# EAGLE design SCC (EAGLE 9.6.2)
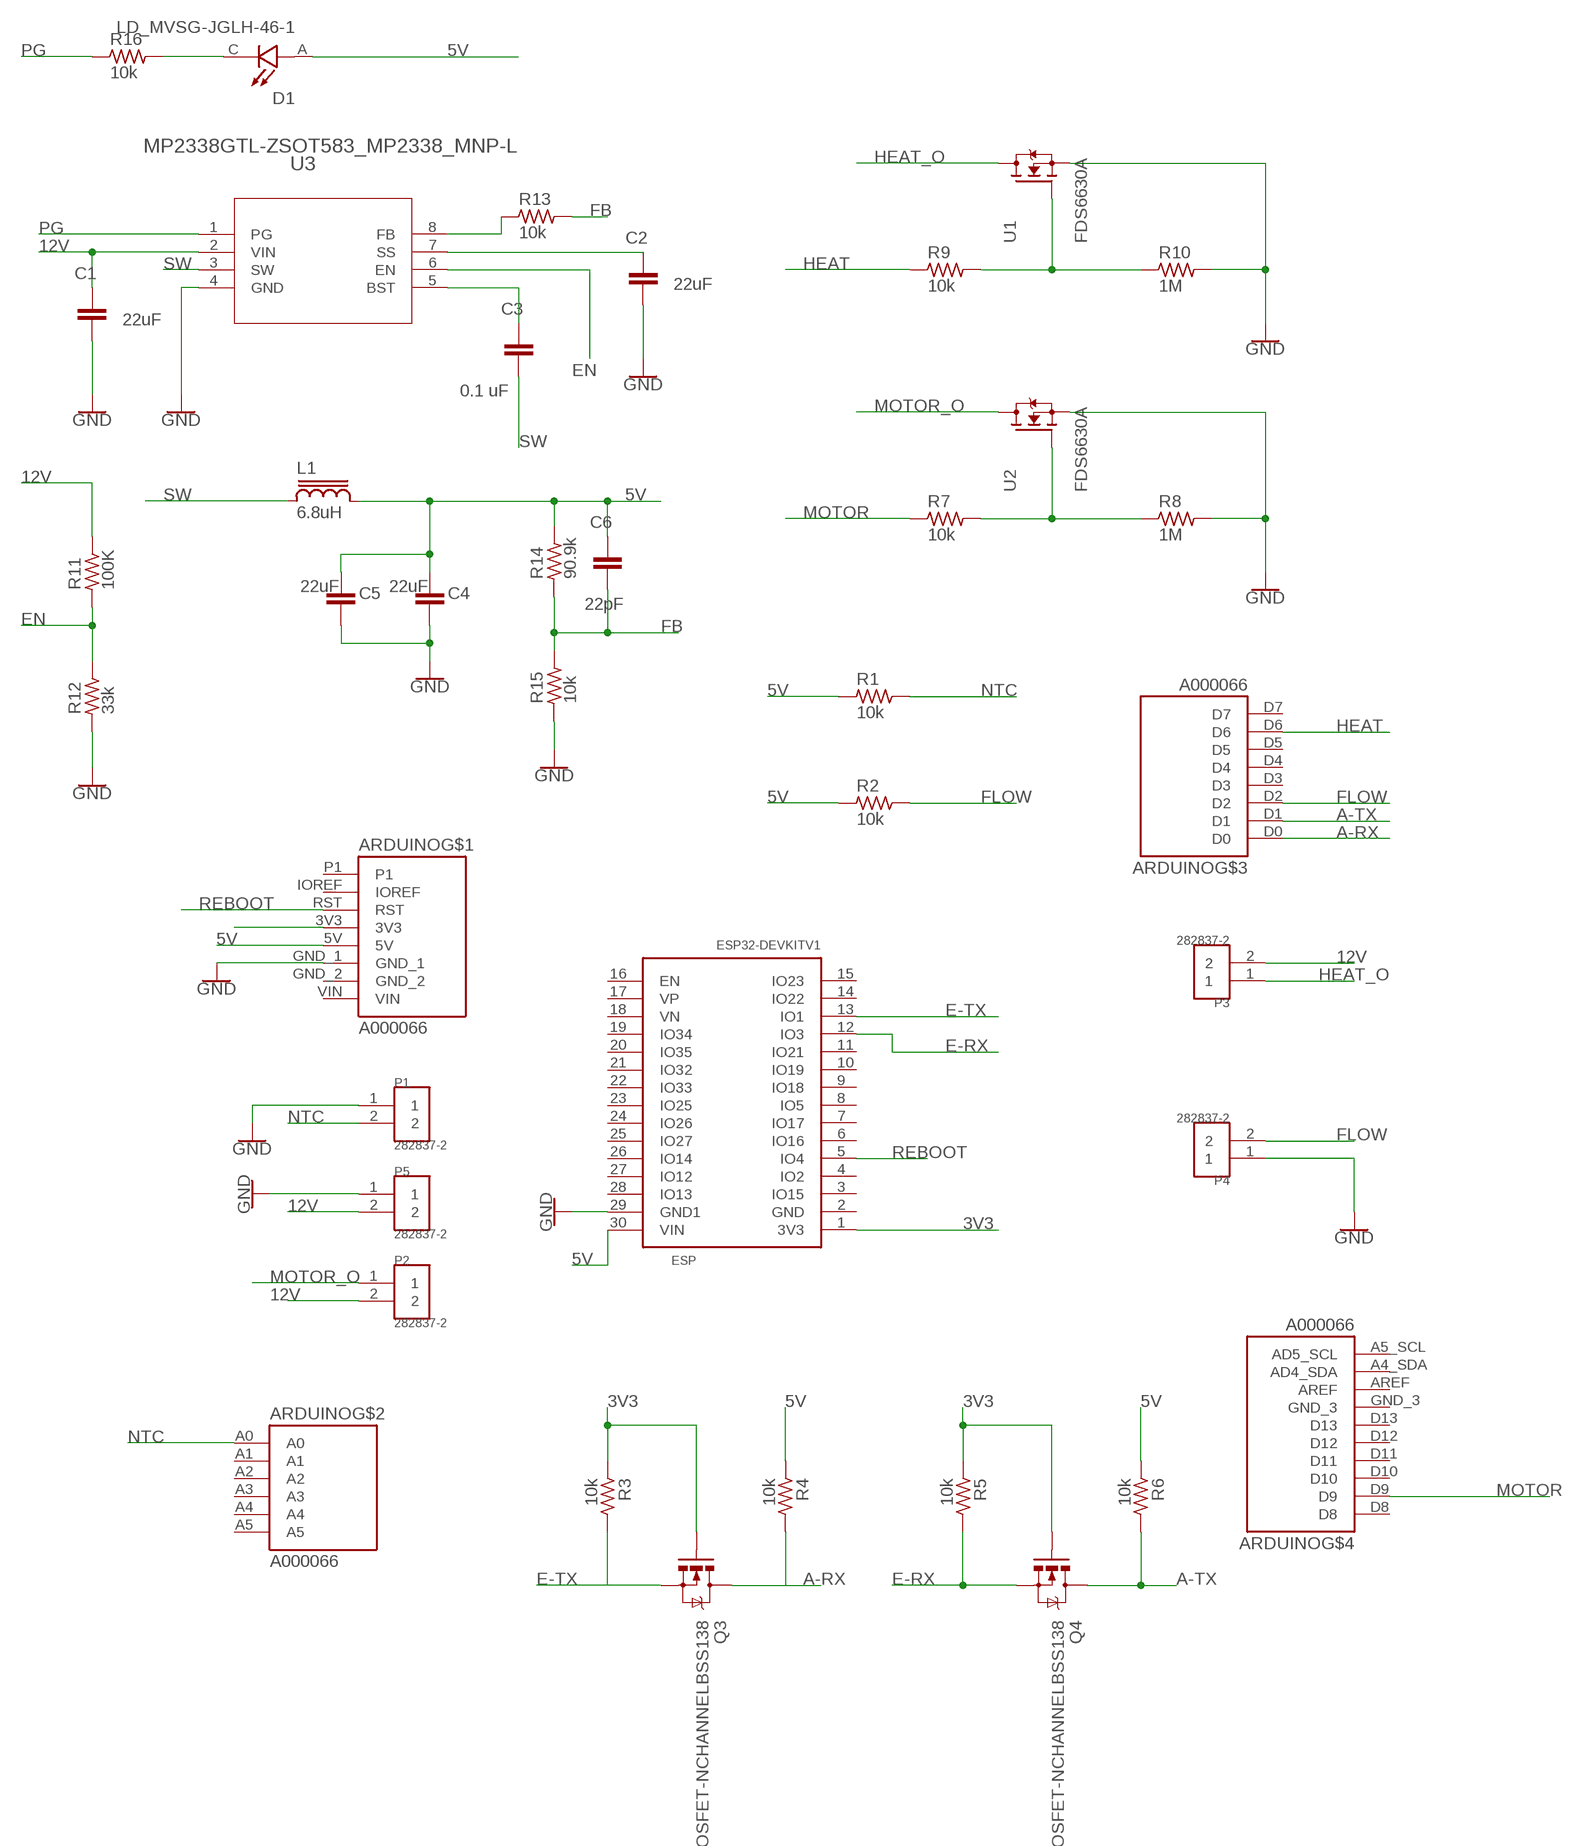
[diagram p0: schematic, sheet 1]

## Parts
ARDUINO  A000066  [ARDUINO_A000066]
C1  22uF  GRM31CR60J107ME39L  [CAP_1206]
C2  22uF  GRM31CR60J107ME39L  [CAP_1206]
C3  0.1 uF  CC0805KRX7R9BB104  [CAP_0805]
C4  22uF  GRM31CR60J107ME39L  [CAP_1206]
C5  22uF  GRM31CR60J107ME39L  [CAP_1206]
C6  22pF  CC0805KRX7R9BB104  [CAP_0805]
D1  LD_MVSG-JGLH-46-1  [LED_LD_MVSG-JGLH-46-1]
ESP  ESP32DEVKITV1  [ESP32-DEVKITV1]
L1  6.8uH  INDUCTOR-BOURNS_SRN8040  [INDUCTOR-BOURNS_SRN8040]
P1  282837-2  [TE_282837-2]
P2  282837-2  [TE_282837-2]
P3  282837-2  [TE_282837-2]
P4  282837-2  [TE_282837-2]
P5  282837-2  [TE_282837-2]
Q3  MOSFET-NCHANNELBSS138  [SOT23]
Q4  MOSFET-NCHANNELBSS138  [SOT23]
R1  10k  RC-MASTER-SMD_R_0603MP  [RC-MASTER-SMD_R0603MP]
R2  10k  RC-MASTER-SMD_R_0603MP  [RC-MASTER-SMD_R0603MP]
R3  10k  RC-MASTER-SMD_R_0603MP  [RC-MASTER-SMD_R0603MP]
R4  10k  RC-MASTER-SMD_R_0603MP  [RC-MASTER-SMD_R0603MP]
R5  10k  RC-MASTER-SMD_R_0603MP  [RC-MASTER-SMD_R0603MP]
R6  10k  RC-MASTER-SMD_R_0603MP  [RC-MASTER-SMD_R0603MP]
R7  10k  RC-MASTER-SMD_R_0603MP  [RC-MASTER-SMD_R0603MP]
R8  1M  RC-MASTER-SMD_R_0603MP  [RC-MASTER-SMD_R0603MP]
R9  10k  RC-MASTER-SMD_R_0603MP  [RC-MASTER-SMD_R0603MP]
R10  1M  RC-MASTER-SMD_R_0603MP  [RC-MASTER-SMD_R0603MP]
R11  100K  RC-MASTER-SMD_R_0603MP  [RC-MASTER-SMD_R0603MP]
R12  33k  RC-MASTER-SMD_R_0603MP  [RC-MASTER-SMD_R0603MP]
R13  10k  RC-MASTER-SMD_R_0603MP  [RC-MASTER-SMD_R0603MP]
R14  90.9k  RC-MASTER-SMD_R_0603MP  [RC-MASTER-SMD_R0603MP]
R15  10k  RC-MASTER-SMD_R_0603MP  [RC-MASTER-SMD_R0603MP]
R16  10k  RC-MASTER-SMD_R_0603MP  [RC-MASTER-SMD_R0603MP]
U1  FDS6630A  [SOIC127P600X175-8N]
U2  FDS6630A  [SOIC127P600X175-8N]
U3  MP2338GTL-ZSOT583_MP2338_MNP-L  [SOT583_MP2338_MNP-L]

## Nets
3V3: ESP.1(3V3) Q3.1(G) Q4.1(G) R3.1 R5.1
5V: ARDUINO.5V C4.1 C5.1 C6.1 D1.A ESP.30(VIN) L1.2 R1.1 R2.1 R4.1 R6.1 R14.2
12V: C1.1 P2.2 P3.2 P5.2 R11.2 U3.2(VIN)
A-RX: ARDUINO.D0 Q3.3(D) R4.2
A-TX: ARDUINO.D1 Q4.3(D) R6.2
E-RX: ESP.12(IO3) Q4.2(S) R5.2
E-TX: ESP.13(IO1) Q3.2(S) R3.2
EN: R11.1 R12.2 U3.6(EN)
FB: C6.2 R13.2 R14.1 R15.2
FLOW: ARDUINO.D2 P4.2 R2.2
GND: ARDUINO.GND_1 C1.2 C2.2 C4.2 C5.2 ESP.29(GND1) P1.1 P4.1 P5.1 R8.2 R10.2 R12.1 R15.1 U1.1(S) U1.2(S) U1.3(S) U2.1(S) U2.2(S) U2.3(S) U3.4(GND)
HEAT: ARDUINO.D6 R9.1
HEAT_O: P3.1 U1.5(D) U1.6(D) U1.7(D) U1.8(D)
MOTOR: ARDUINO.D9 R7.1
MOTOR_O: P2.1 U2.5(D) U2.6(D) U2.7(D) U2.8(D)
N$1: ARDUINO.3V3
N$2: R7.2 R8.1 U2.4(G)
N$3: R9.2 R10.1 U1.4(G)
N$4: C3.1 U3.5(BST)
N$5: C2.1 U3.7(SS)
N$7: D1.C R16.2
N$8: R13.1 U3.8(FB)
NTC: ARDUINO.A0 P1.2 R1.2
PG: R16.1 U3.1(PG)
REBOOT: ARDUINO.RST ESP.5(IO4)
SW: C3.2 L1.1 U3.3(SW)
Unconnected: ARDUINO.A1 ARDUINO.A2 ARDUINO.A3 ARDUINO.A4 ARDUINO.A4_SDA(AD4_SDA) ARDUINO.A5 ARDUINO.A5_SCL(AD5_SCL) ARDUINO.AREF ARDUINO.D3 ARDUINO.D4 ARDUINO.D5 ARDUINO.D7 ARDUINO.D8 ARDUINO.D10 ARDUINO.D11 ARDUINO.D12 ARDUINO.D13 ARDUINO.IOREF ARDUINO.P1 ESP.2(GND) ESP.3(IO15) ESP.4(IO2) ESP.6(IO16) ESP.7(IO17) ESP.8(IO5) ESP.9(IO18) ESP.10(IO19) ESP.11(IO21) ESP.14(IO22) ESP.15(IO23) ESP.16(EN) ESP.17(VP) ESP.18(VN) ESP.19(IO34) ESP.20(IO35) ESP.21(IO32) ESP.22(IO33) ESP.23(IO25) ESP.24(IO26) ESP.25(IO27) ESP.26(IO14) ESP.27(IO12) ESP.28(IO13)

## Power pins joined to a net without a drawn wire
GND_2: ARDUINO.GND_2
GND_3: ARDUINO.GND_3
VIN: ARDUINO.VIN

## Library data of the parts
ARDUINO = A000066:A000066: Check availability <https://pricing.snapeda.com/parts/A000066/Arduino/view-part?ref=eda>; AVAILABILITY: In Stock; CHECK_PRICES: https://www.snapeda.com/parts/A000066/Arduino/view-part/?ref=eda; DESCRIPTION: Arduino UNO Rev3 Microcontroller Board, ATmega328P | Arduino A000066; MF: Arduino; MP: A000066; PACKAGE: Non-Standard Arduino; PRICE: None; PURCHASE-URL: https://www.snapeda.com/api/url_track_click_mouser/?unipart_id=7027813&manufacturer=Arduino&part_name=A000066&search_term=arduino uno r3; SNAPEDA_LINK: https://www.snapeda.com/parts/A000066/Arduino/view-part/?ref=snap
C1 C2 C4 C5 = Resistor_Capacitor:GRM31CR60J107ME39L: CAP CER 100UF 6.3V X5R 1206 Manufacturer's datasheet <https://www.murata.com/~/media/webrenewal/support/library/catalog/products/capacitor/mlcc/c02e.ashx?la=en-us>; CREATED_BY: PCBLayout.com; DIGIKEY_PART_NUMBER: GRM31CR60J107ME39L; MANUFACTURER: Murata Electronics North America; MPN: GRM31CR60J107ME39L; PACKAGE: SMD 1206
C3 C6 = Resistor_Capacitor:CC0805KRX7R9BB104: CAP CER 0.1UF 50V X7R 0805 Manufacturer's datasheet <http://www.yageo.com/documents/recent/UPY-GPHC_X7R_6.3V-to-50V_18.pdf>; CREATED_BY: PCBLayout.com; DIGIKEY_PART_NUMBER: 311-1140-2-ND; MANUFACTURER: Yageo; MPN: CC0805KRX7R9BB104; PACKAGE: SMD 0805
D1 = LD_MVSG-JGLH-46-1:LD_MVSG-JGLH-46-1: Check availability <https://pricing.snapeda.com/parts/LCW%20MVSG.EC-AZBZ-4R9T-1/OSRAM%20Opto/view-part?ref=eda>; AVAILABILITY: In Stock; CHECK_PRICES: https://www.snapeda.com/parts/LCW%20MVSG.EC-AZBZ-4R9T-1/OSRAM+Opto+Semiconductors+Inc./view-part/?ref=eda; DESCRIPTION: LED Lighting Mini TOPLED White, Warm 3000K 3.05V 20mA 120° 2-SMD, J-Lead; MF: OSRAM Opto; MP: LCW MVSG.EC-AZBZ-4R9T-1; PACKAGE: SMD-2 Osram Opto; PRICE: None; SNAPEDA_LINK: https://www.snapeda.com/parts/LCW%20MVSG.EC-AZBZ-4R9T-1/OSRAM+Opto+Semiconductors+Inc./view-part/?ref=snap
ESP = ESP32-DEVKITV1:ESP32DEVKITV1
L1 = 52101-101-REV-A_v16:INDUCTOR-BOURNS_SRN8040: POWER INDUCTOR
P1-P5 = 282837-2:282837-2; AVAILABILITY: Good; DESCRIPTION: TERMINAL BLOCK 3.5MM 2POS PCB; MF: On Shore; MP: OSTTE020104; PACKAGE: None; PARTREV: G3; PRICE: 0.28 USD
Q3 Q4 = BeagleBone_Blue_R3:MOSFET-NCHANNEL: Common NMOSFET Parts MFG P/N Store ID Prod ID FDD8780 TRANS-09984 SI7820DN TRANS-11055 FDS6630A IC-08089 2N7002PW TRANS-11151 FQP30N06L COM-10213 TRANS-10060 BSS123LT1G TRANS-08345 BSS138 TRANS-00830 BS170 2N7000; PROD_ID: TRANS-00830
R1-R16 = 52101-101-REV-A_v16:RC-MASTER-SMD_R_: RESISTOR
U1 U2 = FDS6630A:FDS6630A; MANUFACTURER: ON SEMICONDUCTOR; MAXIMUM_PACKAGE_HEIGHT: 1.75 mm; PARTREV: C1; STANDARD: IPC 7351B
U3 = 2026-03-09_21-39-12_Library:MP2338GTL-Z; COPYRIGHT: Copyright (C) 2026 Ultra Librarian. All rights reserved.; DATASHEET: https://www.monolithicpower.com/en/documentview/productdocument/index/version/2/document_type/Datasheet/lang/en/sku/MP2338GTL; DESCRIPTION: High-Efficiency 28V 3A 450kHz Synchronous Step-Down Converter In SOT583 Package; MANUFACTURER_NAME: Monolithic Power Systems; MANUFACTURER_PART_NUMBER: MP2338GTL-Z

## Board
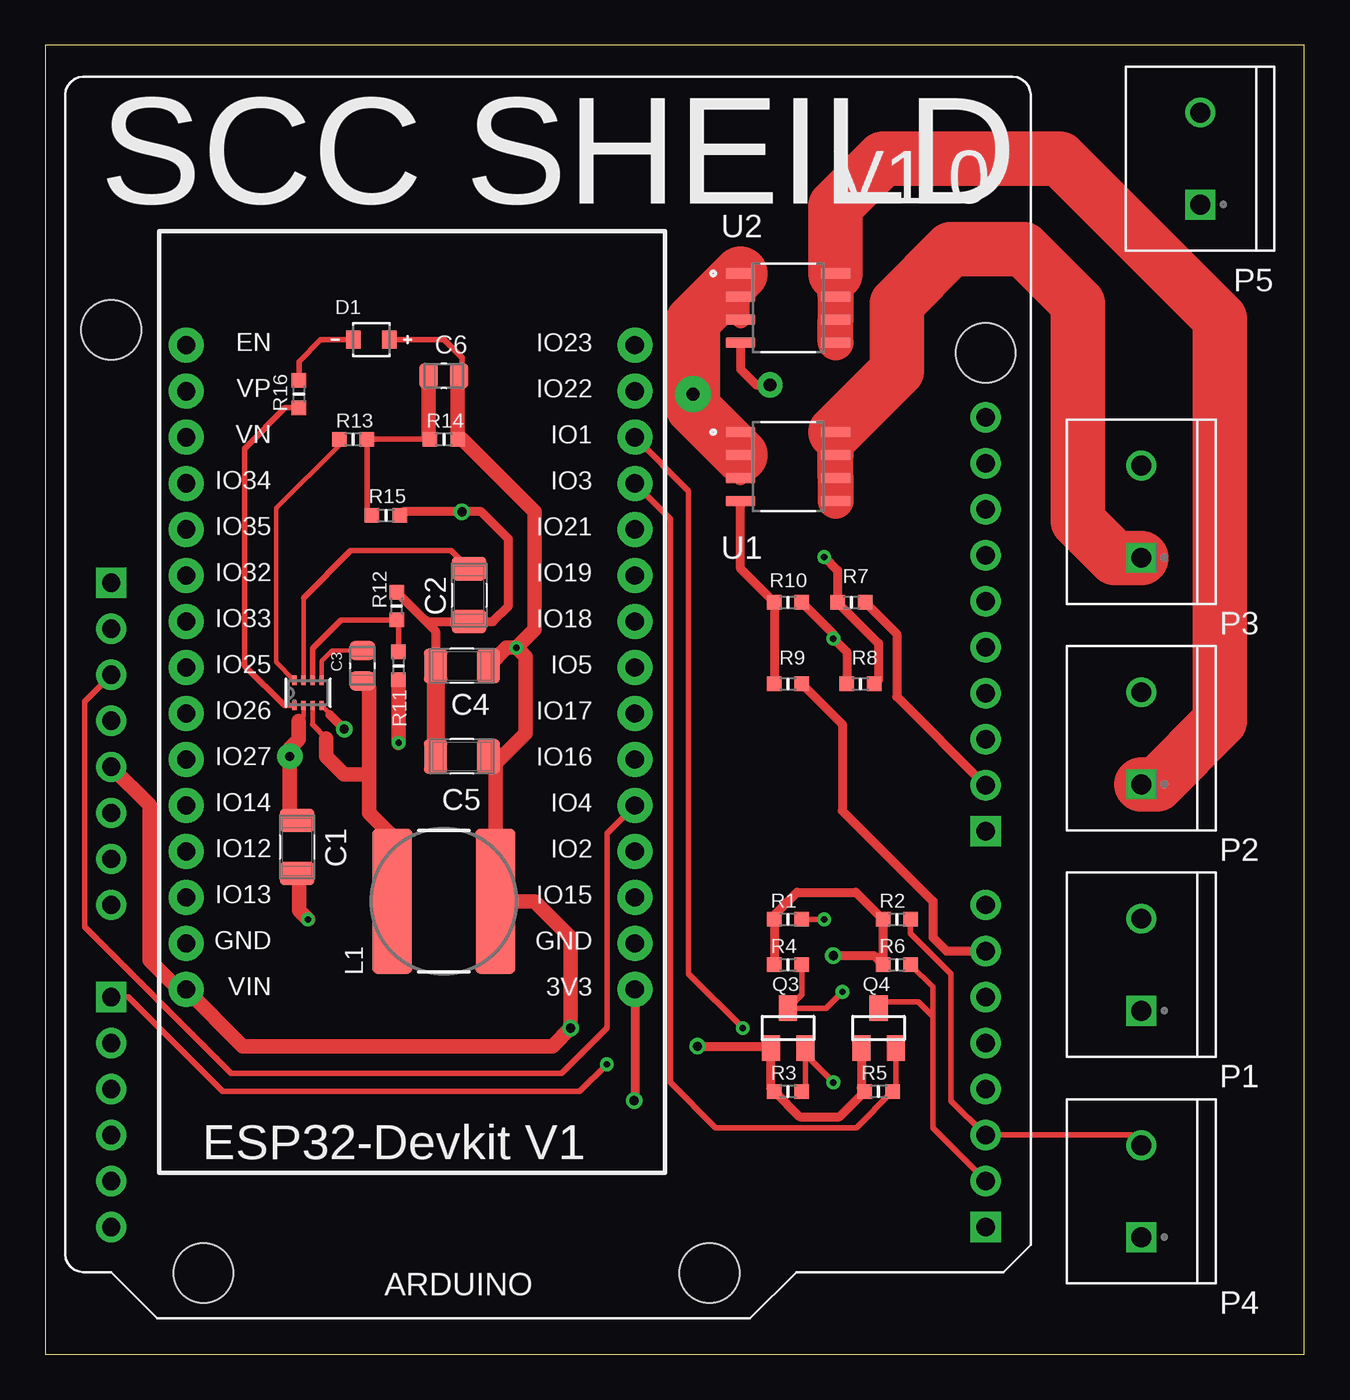
[diagram p1: board, top side]
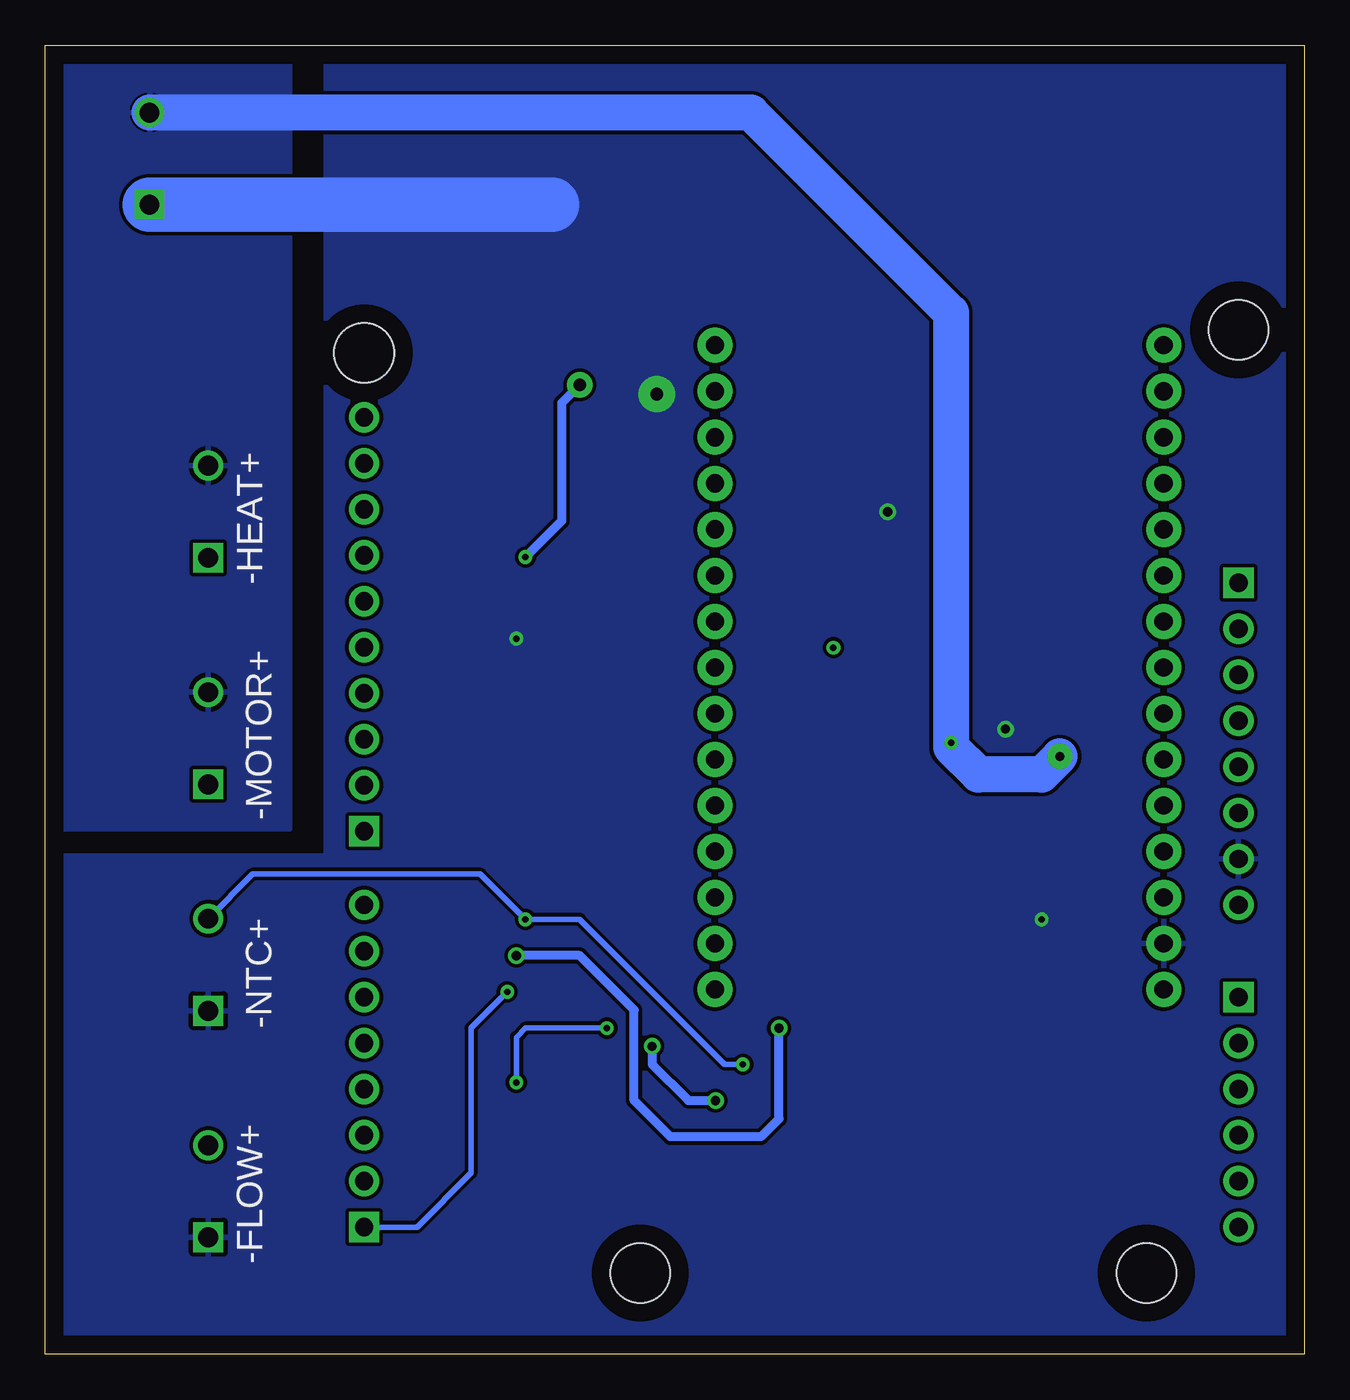
[diagram p2: board, bottom side, seen from below]

Size 69.5 x 72.25 mm. Coordinates in mm from the lower left corner, seen from the top.
Outline: 0,72.25 0,0 69.5,0 69.5,72.25 0,72.25
Copper layers (1*16): Top 0.035mm / dielectric 1.5mm / Bottom 0.035mm
Design rules "default *": minimum track width 6mil, minimum drill 0.35mm, track to track 8mil, track to pad 8mil, pad to pad 8mil, via to via 8mil, smd to smd 8mil, copper to edge 40mil, drill to drill 6mil, minimum pad ring 10mil, minimum via ring 8mil, stop-mask expansion 4mil, vias tented up to drill 0mil, thermal gap 10mil

### Footprints (pad centres in the part's own frame; a part is rotated, then mirrored left to right if it is on the bottom)
ARDUINO_A000066 = drill 1.016 pad 1.676: 3V3 1.293,-24.109; 5V 3.833,-24.109; A1 19.073,-24.109; A2 21.613,-24.109; A3 24.153,-24.109; A4 26.693,-24.109; A4_SDA -12.931,24.151; A5 29.233,-24.109; A5_SCL -15.471,24.151; AREF -10.391,24.151; D1 26.693,24.151; D2 24.153,24.151; D3 21.613,24.151; D4 19.073,24.151; D5 16.533,24.151; D6 13.993,24.151; D7 11.453,24.151; D9 4.849,24.151; D10 2.309,24.151; D11 -0.231,24.151; D12 -2.771,24.151; D13 -5.311,24.151; GND_1 8.913,-24.109; GND_2 6.373,-24.109; GND_3 -7.851,24.151; IOREF -3.787,-24.109; RST -1.247,-24.109; VIN 11.453,-24.109 | drill 1.016 pad 1.676 square: A0 16.533,-24.109; D0 29.233,24.151; D8 7.389,24.151; P1 -6.327,-24.109 | hole 3.3: 31.773,8.911; 31.773,-19.029; -19.027,24.151; -20.297,-24.109
CAP_1206 = smd 1.29 x 1.91: 1 -1.46,0; 2 1.46,0
CAP_0805 = smd 1.05 x 1.38: 1 -0.84,0; 2 0.84,0
LED_LD_MVSG-JGLH-46-1 = smd 0.8 x 1: A 1,0; C -1,0
ESP32-DEVKITV1 = drill 1 pad 1.93: 1 -22.87,-13.54; 2 -20.33,-13.54; 3 -17.79,-13.54; 4 -15.25,-13.54; 5 -12.71,-13.54; 6 -10.17,-13.54; 7 -7.63,-13.54; 8 -5.09,-13.54; 9 -2.55,-13.54; 10 -0.01,-13.54; 11 2.53,-13.54; 12 5.07,-13.54; 13 7.61,-13.54; 14 10.15,-13.54; 15 12.69,-13.54; 16 12.69,11.23; 17 10.15,11.23; 18 7.61,11.23; 19 5.07,11.23; 20 2.53,11.23; 21 -0.01,11.23; 22 -2.55,11.23; 23 -5.09,11.23; 24 -7.63,11.23; 25 -10.17,11.23; 26 -12.71,11.23; 27 -15.25,11.23; 28 -17.79,11.23; 29 -20.33,11.23; 30 -22.87,11.23
INDUCTOR-BOURNS_SRN8040 = smd 8 x 2.2: 1 0,2.85; 2 0,-2.85
TE_282837-2 = drill 1.1 square: 1 -2.54,0 | drill 1.1: 2 2.54,0
SOT23 = smd 1 x 1.4: 1 -0.95,-1.1; 2 0.95,-1.1; 3 0,1.1
RC-MASTER-SMD_R0603MP = smd 0.8 x 0.8: 1 -0.762,0; 2 0.762,0
SOIC127P600X175-8N = smd 1.66 x 0.6: 1 -2.625,1.905; 2 -2.625,0.635; 3 -2.625,-0.635; 4 -2.625,-1.905; 5 2.625,-1.905; 6 2.625,-0.635; 7 2.625,0.635; 8 2.625,1.905
SOT583_MP2338_MNP-L = smd 0.508 x 0.229: 1 -0.699,0.75; 2 -0.699,0.25; 3 -0.699,-0.25; 4 -0.699,-0.75; 5 0.699,-0.75; 6 0.699,-0.25; 7 0.699,0.25; 8 0.699,0.75

### Placement (x,y rotation side)
ARDUINO  27.75,36.25 270 top
C1  13.9,28 270 top
C2  23.4,41.9 270 top
C3  17.5,38 270 top
C4  23,38 180 top
C5  23,33 180 top
C6  22,54 180 top
D1  18,56 0 top
ESP  19,43 90 top
L1  22,25 90 top
P1  60.5,21.5 90 top
P2  60.5,34 90 top
P3  60.5,46.5 90 top
P4  60.5,9 90 top
P5  63.75,66 90 top
Q3  41,18 0 top
Q4  46,18 0 top
R1  41,24 0 top
R2  47,24 0 top
R3  41,14.5 0 top
R4  41,21.5 0 top
R5  46,14.5 0 top
R6  47,21.5 0 top
R7  44.5,41.5 180 top
R8  45,37 180 top
R9  41,37 180 top
R10  41,41.5 0 top
R11  19.5,38 270 top
R12  19.4,41.3 270 top
R13  17,50.5 0 top
R14  22,50.5 0 top
R15  18.8,46.3 180 top
R16  14,53 90 top
U1  41,49 0 top
U2  41,57.75 0 top
U3  14.5,36.5 90 top

### Tracks (layer width: path | path; a pad name or v marks a point on that pad's centre or on a via)
3V3  (via drill 0.5)
  Top 0.5: Q4.1 45.05,14.69 R5.1 43.84,13.1 41.63,13.1 R3.1 40.05,14.69 Q3.1 39.95,17 v36,17 | ESP.1 32.54,14.04 v32.5,14
  Bottom 0.5: v36,17 36,16 34,14 v32.5,14
5V  (via drill 0.35, 0.5)
  Top 0.3: 22.76,53.92 23,54.16 23,55 22,56 D1.A
  Top 0.5: R4.1 R1.1 40.24,24.24 41.5,25.5 44.74,25.5 R2.1 R6.1 45.74,22 v43.5,22
  Top 0.8: 24.85,32.61 L1.2 27,25 29,23 v29,18 28,17 10.9,17 ESP.30 7.37,20.13 5.75,21.75 5.75,30.31 ARDUINO.5V | v26,39 26.5,38.5 26.5,34.26 24.85,32.61 | v26,39 27,40 27,46.5 23,50.5 R14.2 22.76,53.92 C6.1 | 24.85,33.19 24.85,32.61 | 24.85,32.61 C5.1 | C4.1 25.46,39 v26,39
  Bottom 0.5: v29,18 29,13 30,12 35,12 37,14 37,19 40,22 v43.5,22
12V  (via drill 0.35, 0.5 pad 1.4)
  Top 0.25: U3.2 14.25,35.2 14,34.94
  Top 0.8: C1.1 13.5,29.86 v13.5,33 13.5,33.45 14,33.94 14,34.94 | R11.2 v19.5,33.75
  Bottom 2: v13.5,33 14.5,32 18,32 19.5,33.5 v19.5,33.75 19.5,57.5 30.54,68.54 P5.2
  pour Bottom: 56,29 71,29 71,72 69,74 57,74 56,73
A-RX  (via drill 0.35)
  Top 0.3: R4.2 41.76,20 41.76,19.86 Q3.3 43.1,19.1 v44,20
  Bottom 0.3: v44,20 46,18 46,10 48.98,7.02 ARDUINO.D0
A-TX
  Top 0.3: Q4.3 46.35,19.45 48.19,19.45 49,18.64 | 49,18.64 49,12.5 51.9,9.6 ARDUINO.D1 | 49,18.64 49,20.26 R6.2
E-RX
  Top 0.3: Q4.2 46.95,14.69 R5.2 44.76,12.5 37,12.5 34.5,15 34.5,46.11 ESP.12
E-TX  (via drill 0.35)
  Top 0.3: ESP.13 35.5,47.65 35.5,21 v38.5,18 | R3.2 41.95,14.69 Q3.2 41.95,16.55 v43.5,15
  Bottom 0.3: v38.5,18 43,18 43.5,17.5 v43.5,15
EN
  Top 0.3: U3.6 14.75,38.95 16.34,40.54 R12.2 19.5,40.44 R11.1
FB
  Top 0.3: R14.1 R13.2 17.76,46.58 R15.2
  Top 0.5: 21.16,50.58 R14.1
  Top 0.8: C6.2 21.16,50.58
FLOW
  Top 0.3: R2.2 47.76,23.24 50,21 50,14 ARDUINO.D2 59.94,12.1 P4.2
GND  (via drill 0.35, 0.5, 0.7 pad 2)
  Top 0.25: U3.4 15.75,35.3
  Top 0.3: 15.75,35.3 15.7,35.3
  Top 0.5: 20.96,40.5 21,40.5 21.06,40.44 C2.2 24.7,40.44 25.56,41.3 25.56,45 24.06,46.5 v23,46.5 19.76,46.5 R15.1 | R12.1 20.96,40.5 | 15.7,35.3 v16.5,34.5 | R10.2 43.5,39.76 v43.5,39.5 44.24,38.76 R8.2 | 20.96,40.5 21.54,39.92 C4.2
  Top 0.8: C1.2 14,26.44 14,24.5 v14.5,24 | U1.3 U1.2 U1.1
  Top 1: U2.1 U2.2 U2.3 | C4.2 C5.2
  Top 3: U1.2 35.75,52.26 v35.75,53 35.75,57.03 U2.1
  Bottom 3: P5.1 41.54,63.46
  pour Bottom: 71,27.5 71,0.25 68.75,-2 0,-2 -2,0 -2,72 0,74 52,74 54,72 54,27.5
HEAT
  Top 0.5: R9.1 44,34.76 44,30 49,25 49,23 49.74,22.26 ARDUINO.D6
HEAT_O
  Top 2: U1.8 U1.7 U1.6 U1.5
  Top 3: U1.8 47,54.28 47,58 50,61 54,61 57,58 57,46 59.04,43.96 P3.1
MOTOR
  Top 0.5: R7.1 47,39.76 47,36.3 ARDUINO.D9
MOTOR_O
  Top 2: U2.5 U2.6 U2.7 U2.8
  Top 3: U2.8 43.62,63.38 46.25,66 56,66 64.83,57.17 64.83,34.94 61.35,31.46 P2.1
N$2  (via drill 0.35, 0.7 pad 1.4)
  Top 0.5: U2.4 38.38,54.38 39.25,53.5 v40,53.5 | R8.1 46,37.24 46,39.24 R7.2 43.74,43.26 v43,44
  Bottom 0.5: v40,53.5 41,52.5 41,46 v43,44
N$3
  Top 0.5: R9.2 R10.1 38.38,43.36 U1.4
N$4
  Top 0.25: U3.5 15.25,38.25 15.84,38.84 C3.1
N$5
  Top 0.25: U3.7 14.25,41.75
  Top 0.3: C2.1 22.4,44.36 16.86,44.36 14.25,41.75
N$7
  Top 0.3: R16.2 14,54.79 15.21,56 D1.C
N$8
  Top 0.25: R13.1 16.24,50.19 12.75,46.7 12.75,38.2 U3.8
NTC  (via drill 0.35)
  Top 0.3: R1.2 v43,24 | v31,16 29.5,14.5 9.79,14.5 4.57,19.72 ARDUINO.A0
  Bottom 0.3: v31,16 32,16 40,24 v43,24 45.5,26.5 58.04,26.5 P1.2
PG
  Top 0.3: U3.1 13.2,35.8 11,38 11,50 13.24,52.24 R16.1
REBOOT
  Top 0.3: ARDUINO.RST 2.17,36.02 2.17,23.58 10.25,15.5 28.5,15.5 31,18 31,28.75 ESP.5
SW
  Top 0.25: U3.3 14.75,34.75
  Top 0.3: 14.75,34.75 15.5,34
  Top 0.8: L1.1 19.15,28.6 17.88,29.88 17.88,32 | C3.2 17.88,36.78 17.88,32 | 15.5,34 15.5,33 16.5,32 17.88,32

### Text on the board
tPlace: SCC SHEILD | V1.0
bPlace: -HEAT+ | -MOTOR+ | -NTC+ | -FLOW+